# Altium schematic sheet NixieDriver.SchDoc: OmegaV Nixie Imponator
size A; Author: Ole Sivert Aarhaug
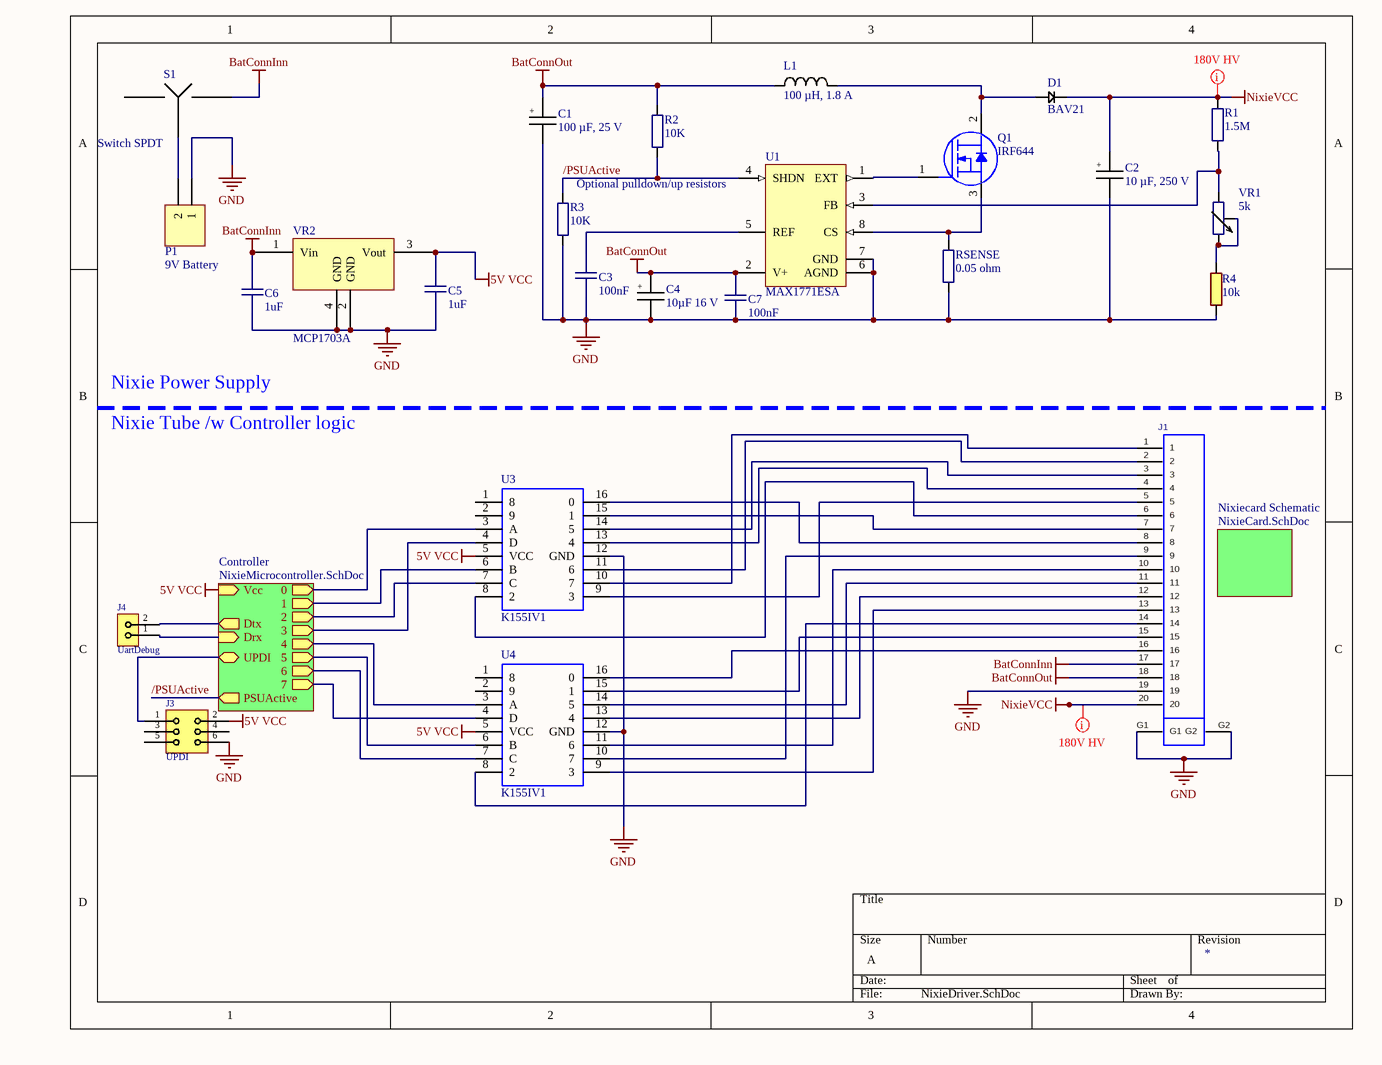
[diagram p0: NixieDriver.SchDoc, right]

## Parts
C1  100 µF, 25 V  [CAPAE9583X65M]
C2  10 µF, 250 V  [CAPAE112103X170M]
C3  100nF  [CAPC0805(2012)100_N]
C4  10µF 16 V  [CAPAE5542X55M]
C5  1uF  [CAPC0805(2012)100_N]
C6  1uF  [CAPC0805(2012)100_N]
C7  100nF  [CAPC0805(2012)100_N]
D1  BAV21  [DO-41]
J1  ZF1-20-01-XX-WT  [ZF1-20-01-XX-WT]  (value not drawn)
J3  UPDI  [HDRV6W64P254_2X3_762X508X900B]
J4  UartDebug  [HDRV2W64P254_1X2_508X254X900B]
L1  100 µH, 1.8 A  [B82479A1]
P1  9V Battery  [HDR1X2]
Q1  IRF644  [TO-220-3P]
R1  1.5M  [RC2512]
R2  10K  [R0805]
R3  10K  [R0805]
R4  10k  [RESC0805(2012)_N]
RSENSE  0.05 ohm  [LR2010]
S1  Switch SPDT  [3TH]
U1  MAX1771ESA  [S8-5_L]
U3  K155IV1  [CircuitWorks-DIP16]
U4  K155IV1  [CircuitWorks-DIP16]
VR1  5k  [PVG3A trimpot]
VR2  MCP1703A  [SOT230P700X180-4N]

## Sub-sheets
Controller = NixieMicrocontroller.SchDoc: 0 (out), 1 (out), 2 (out), 3 (out), 4 (out), 5 (out), 6 (out), 7 (out), Vcc (in), Dtx (out), Drx (in), UPDI (bidir), PSUActive (out)
Nixiecard Schematic = NixieCard.SchDoc: no entries

## Nets
5V VCC: C5.2 J3.2(VCC) U3.5(VCC) U4.5(VCC) VR2.3(Vout) ; sheet Controller/Vcc
BatConnInn: C6.2 J1.17 S1.3(K) VR2.1(Vin)
BatConnOut: C1.1 C4.1 C7.1 J1.18 L1.1 R2.2 U1.2(V+)
GND: C1.2 C2.2 C3.1 C4.2 C5.1 C6.1 C7.2 J1.19 J1.G1 J1.G2 J3.6(GND) P1.1 R3.1 R4.1 RSENSE.1 U1.6(AGND) U1.7(GND) U3.12(GND) U4.12(GND) VR2.2(GND) VR2.4(GND)
NixieVCC: C2.1 D1.2(K) J1.20 R1.2
/PSUActive: R2.1 R3.2 U1.4(SHDN) ; sheet Controller/PSUActive
NetC3_2: C3.2 U1.5(REF)
NetD1_1: D1.1(A) L1.2 Q1.2(Source)
NetJ1_1: J1.1 U3.10(7)
NetJ1_2: J1.2 U3.11(6)
NetJ1_3: J1.3 U3.14(5)
NetJ1_4: J1.4 U3.13(4)
NetJ1_5: J1.5 U3.9(3)
NetJ1_6: J1.6 U3.8(2)
NetJ1_7: J1.7 U3.15(1)
NetJ1_8: J1.8 U3.16(0)
NetJ1_9: J1.9 U4.10(7)
NetJ1_10: J1.10 U4.11(6)
NetJ1_11: J1.11 U4.14(5)
NetJ1_12: J1.12 U4.13(4)
NetJ1_13: J1.13 U4.9(3)
NetJ1_14: J1.14 U4.8(2)
NetJ1_15: J1.15 U4.15(1)
NetJ1_16: J1.16 U4.16(0)
NetJ3_1: J3.1(UDPI) ; sheet Controller/UPDI
NetJ4_1: J4.1 ; sheet Controller/Drx
NetJ4_2: J4.2 ; sheet Controller/Dtx
NetP1_2: P1.2 S1.2(K)
NetQ1_1: Q1.1(Gate) U1.1(EXT)
NetQ1_3: Q1.3(Drain) RSENSE.2 U1.8(CS)
NetR1_1: R1.1 U1.3(FB) VR1.3
NetR4_2: R4.2 VR1.1 VR1.2
NetU3_3: U3.3(A) ; sheet Controller/0
NetU3_4: U3.4(D) ; sheet Controller/3
NetU3_6: U3.6(B) ; sheet Controller/1
NetU3_7: U3.7(C) ; sheet Controller/2
NetU4_3: U4.3(A) ; sheet Controller/4
NetU4_4: U4.4(D) ; sheet Controller/7
NetU4_6: U4.6(B) ; sheet Controller/5
NetU4_7: U4.7(C) ; sheet Controller/6

Not connected (* = marked no-connect by the designer): J3 3 4 5; S1 1(K); U3 1(8) 2(9); U4 1(8) 2(9)

## Layout directives
net class HV: NixieVCC

## Notes on the sheet
- (near U1) Optional pulldown/up resistors
- Nixie Power Supply
- Nixie Tube /w Controller logic
- (in symbol EEEFC1C100R) +
- (in symbol EEEFK1E101P) +
- (in symbol EEVEB2E100Q) +

## Library data of the parts
C1 = EEEFK1E101P: ComponentLink1Description: farnell; ComponentLink1URL: https://no.farnell.com/panasonic/eeefk1e101p/cap-100-f-25v-radial-smd/dp/9695770
C2 = EEVEB2E100Q: ComponentLink1Description: Farnell; ComponentLink1URL: https://no.farnell.com/panasonic/eeveb2e100q/cap-10-f-250v-radial-smd/dp/2326345?st=eeveb2e100q; ComponentLink2Description: Datasheet; ComponentLink2URL: http://www.farnell.com/datasheets/2245254.pdf; Parameter 1: *
C3 C7 = 2445: X7R 50V; id: 2445; rad: 1; rom: OV; lager_type: Fremlager; dybde: 4; hylle: 6; antall: 50; kolonne: 3; pakke_opprettet_av: 815; leverandor_varenr: 2408556; nokkelord: Kondensator, capacitor; produsent: Multikomp; leverandor: Farnell; pakketype: 0805; pakke_opprettet: 14.11.2014 20:52:01; symbol_opprettet_av: 815; symbol_opprettet: 14.11.2014 20:19:34; navn: 100nF; pris: 1
C4 = EEEFC1C100R: ComponentLink1Description: farnell; ComponentLink1URL: https://no.farnell.com/panasonic/eeefc1c100r/cap-10-f-16v-radial-smd/dp/9693491
C5 C6 = 3582: X7R 50V 10%; id: 3582; pakke_opprettet_av: 815; leverandor_varenr: 1735541; pris: 4; nokkelord: Kondensator, capacitor; produsent: Murata; leverandor: Farnell; pakketype: 0805; pakke_opprettet: 14.11.2014 20:52:01; symbol_opprettet_av: 815; symbol_opprettet: 14.11.2014 20:19:34; navn: 1uF
D1 = 1290
J1 = ZF1-20-01-XX-WT: ZERO INSERTION FORCE 1mm ASSEMBLY, BOTTOM CONTACT.
J3 = 3187: id: 3187; pakke_opprettet_av: 815; beskrivelse: 2,54mm pitch; navn: Header 2x3; pris: 3; pakketype: TH; pakke_opprettet: 23.07.2015 20:17:54; symbol_opprettet_av: 815; symbol_opprettet: 13.11.2014 11:03:43
J4 = 2429: id: 2429; pakke_opprettet_av: 815; beskrivelse: 2,54mm pitch; navn: Header 1x2; pris: 1; pakketype: TH; pakke_opprettet: 13.11.2014 12:30:48; symbol_opprettet_av: 815; symbol_opprettet: 13.11.2014 10:58:53
L1 = B82479A1104M
P1 = Header 2: Header, 2-Pin; LatestRevisionDate: 17-Jul-2002; LatestRevisionNote: Re-released for DXP Platform.; Publisher: Altium Limited
Q1 = 4730: Power MOSFET; id: 4730; pakke_opprettet_av: 815; pris: 0; nokkelord: power mosfet, transistor; produsent: Vishay; pakketype: TO-220; pakke_opprettet: 09.06.2015 21:08:41; symbol_opprettet_av: 815; symbol_opprettet: 14.09.2016 15:31:38; navn: IRF644; ComponentLink1Description: farnell; ComponentLink1URL: https://no.farnell.com/vishay/irf644pbf/mosfet-n-250v-14a-to-220/dp/8648409?scope=partnumberlookahead&ost=IRF644PBF&searchref=searchlookahead&exaMfpn=true&ddkey=https%3Ano-NO%2FElement14_Norway%2Fw%2Fsearch
R1-R3 RSENSE = Resistor: ComponentLink1Description: farnell
  R1: ComponentLink1URL: https://no.farnell.com/yageo/rc2512jk-071m5l/res-1m5-5-1w-2512-thick-film/dp/9236058?rpsku=rel3:3258142&isexcsku=false#
  R2 R3 RSENSE: ComponentLink1URL: https://no.farnell.com/tt-electronics-welwyn/lr2010-r05fw/res-0r05-1-1w-2010-thick-film/dp/1100050
R4 = 3584: 0.1W 1% Thick film resistor; id: 3584; pakke_opprettet_av: 815; navn: 1k; pris: 0; nokkelord: Resistor Motstand; produsent: Multikomp; leverandor: Farnell; pakketype: 0805; pakke_opprettet: 27.01.2016 14:23:16; symbol_opprettet_av: 815; symbol_opprettet: 08.07.2014 21:16:33
U1 = CMP-0246-00656-1: 12 V or Adjustable Output, High-Efficiency, Low IQ, Step-Up DC-DC Controller, -40 to 85 degC, 8-Pin SOIC (S8-5), RoHS; Manufacturer: Maxim; VIN: 3 to 16.5 V; Shutdown Current: 5 uA Max.; Preset Vout: 12 V; Supply Current: 110 uA Max.; Reference Voltage: 1.5 V; Mounting Technology: Surface Mount; PackageReference: S8-5; PackageDescription: 8-Pin Small Outline Integrated Circuit Package, Body 4.9 x 3.9 mm, Pitch 1.27 mm; ComponentLink3Description: Package Specification; ComponentLink3URL: http://pdfserv.maximintegrated.com/package_dwgs/21-0041.PDF; ComponentLink2Description: Datasheet; ComponentLink1URL: http://www.maximintegrated.com/; DatasheetVersion: Rev. 2; PackageVersion: Rev. E; RoHS: TRUE; ComponentLink1Description: Manufacturer URL; PartNumber: MAX1771ESA; ComponentLink2URL: http://datasheets.maximintegrated.com/en/ds/MAX1771.pdf; Temperature Range: -40 to 85 degC
U3 U4 = 1463: id: 1463; pakke_opprettet_av: 1607; symbol_opprettet_av: 2099; beskrivelse: Nixie tube driver (K155NB1); pris: 5; pakketype: TH; pakke_opprettet: 25.08.2016 00:00:22; symbol_opprettet: 10.10.2018 20:11:59; navn: K155IV1
VR1 = PVG3A502C01R00: ComponentLink1Description: farnell; ComponentLink1URL: https://no.farnell.com/bourns/pvg3a502c01r00/trimmer-pot-5k-1turn-smd/dp/2709479
VR2 = MCP1703A: ComponentLink1Description: datasheet; ComponentLink1URL: http://ww1.microchip.com/downloads/en/DeviceDoc/20005122B.pdf; ComponentLink2Description: farnell; ComponentLink2URL: https://no.farnell.com/microchip/mcp1703a-5002e-db/ldo-16vin-0-25a-5v-2-3sot223/dp/2113889?st=MCP1703A